# EAGLE design Lab Controller Board (EAGLE 7.3.0)
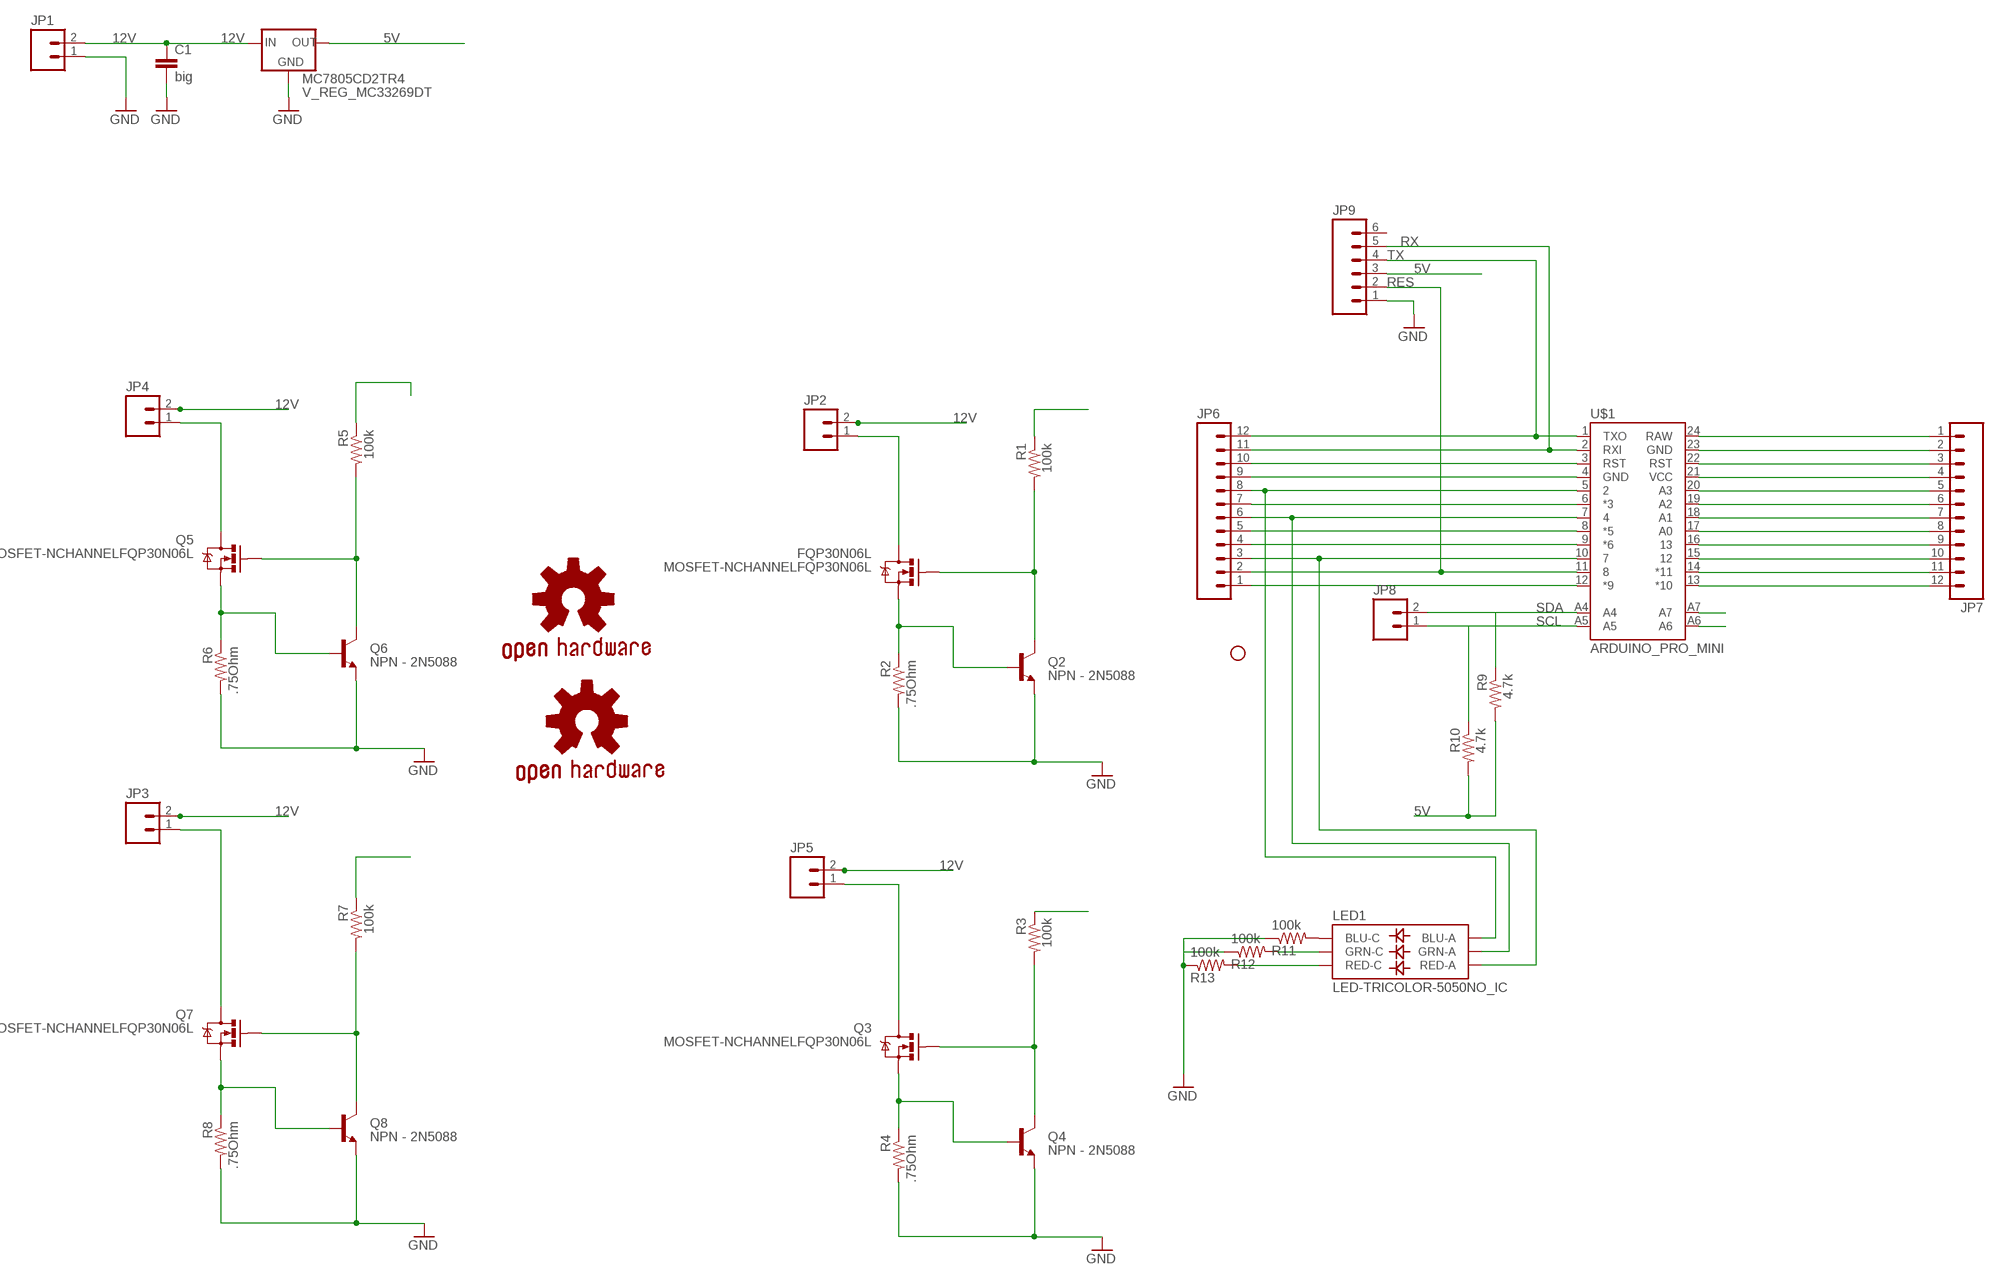
[diagram p0: schematic, sheet 1]

## Parts
C1  big  CAPPTH1  [CAP-PTH-5MM]
FQP30N06L  MOSFET-NCHANNELFQP30N06L  [TO220V]
GOLD_ORB_SM1  OSHWLOGO_GOLD_ORB_MED  [OSHW1]
GOLD_ORB_SM2  OSHWLOGO_GOLD_ORB_SM  [OSHW2]
JP1  M025MM  [SCREWTERMINAL-5MM-2]
JP2  M025MM  [SCREWTERMINAL-5MM-2]
JP3  M025MM  [SCREWTERMINAL-5MM-2]
JP4  M025MM  [SCREWTERMINAL-5MM-2]
JP5  M025MM  [SCREWTERMINAL-5MM-2]
JP6  M12PTH  [1X12]
JP7  M12PTH  [1X12]
JP8  M02LOCK  [1X02_LOCK]
JP9  M06LOCK  [1X06_LOCK]
LED1  LED-TRICOLOR-5050NO_IC  [LED-TRICOLOR-5050]
MC7805CD2TR4  V_REG_MC33269DT  [DPAK]
Q2  NPN - 2N5088  TRANSISTOR_NPNTO92  [TO-92]
Q3  MOSFET-NCHANNELFQP30N06L  [TO220V]
Q4  NPN - 2N5088  TRANSISTOR_NPNTO92  [TO-92]
Q5  MOSFET-NCHANNELFQP30N06L  [TO220V]
Q6  NPN - 2N5088  TRANSISTOR_NPNTO92  [TO-92]
Q7  MOSFET-NCHANNELFQP30N06L  [TO220V]
Q8  NPN - 2N5088  TRANSISTOR_NPNTO92  [TO-92]
R1  100k  R-US_R0805W  [R0805W]
R2  .75Ohm  R-US_0411/3V  [0411V]
R3  100k  R-US_R0805W  [R0805W]
R4  .75Ohm  R-US_0411/3V  [0411V]
R5  100k  R-US_R0805W  [R0805W]
R6  .75Ohm  R-US_0411/3V  [0411V]
R7  100k  R-US_R0805W  [R0805W]
R8  .75Ohm  R-US_0411/3V  [0411V]
R9  4.7k  R-US_M0805  [M0805]
R10  4.7k  R-US_M0805  [M0805]
R11  100k  R-US_R0805W  [R0805W]
R12  100k  R-US_R0805W  [R0805W]
R13  100k  R-US_R0805W  [R0805W]
STANDOFF1  STAND-OFF  [STAND-OFF]
U$1  ARDUINO_PRO_MINI  [ARDUINO_PRO_MINI]

## Nets
5V: JP9.3 MC7805CD2TR4.4(OUT) R9.2 R10.2
12V: C1.1 JP1.2 JP2.2 JP3.2 JP4.2 JP5.2 MC7805CD2TR4.3(IN)
APM_PIN_3: JP6.7 R3.1 U$1.6(*3)
APM_PIN_5: JP6.5 R1.1 U$1.8(*5)
APM_PIN_6: JP6.4 R7.1 U$1.9(*6)
APM_PIN_9: JP6.1 R5.1 U$1.12(*9)
FET_SOURCE: FQP30N06L.3(S) Q2.2(B) R2.1
FET_SOURCE1: Q3.3(S) Q4.2(B) R4.1
FET_SOURCE2: Q5.3(S) Q6.2(B) R6.1
FET_SOURCE3: Q7.3(S) Q8.2(B) R8.1
GND: C1.2 JP1.1 JP9.1 MC7805CD2TR4.1(GND) Q2.1(E) Q4.1(E) Q6.1(E) Q8.1(E) R2.2 R4.2 R6.2 R8.2 R11.1 R12.1 R13.1
LED_DRAIN: FQP30N06L.2(D) JP2.1
LED_DRAIN1: JP5.1 Q3.2(D)
LED_DRAIN2: JP4.1 Q5.2(D)
LED_DRAIN3: JP3.1 Q7.2(D)
N$3: JP6.10 U$1.3(RST)
N$4: JP6.9 U$1.4(GND)
N$5: JP6.8 LED1.3(BLU-A) U$1.5
N$6: LED1.4(BLU-C) R11.2
N$7: JP6.6 LED1.1(GRN-A) U$1.7
N$8: LED1.6(GRN-C) R12.2
N$9: LED1.5(RED-C) R13.2
N$10: JP6.3 LED1.2(RED-A) U$1.10
N$15: JP7.1 U$1.24(RAW)
N$16: JP7.2 U$1.23(GND)
N$17: JP7.3 U$1.22(RST)
N$18: JP7.4 U$1.21(VCC)
N$19: JP7.5 U$1.20(A3)
N$20: JP7.6 U$1.19(A2)
N$21: JP7.7 U$1.18(A1)
N$22: JP7.8 U$1.17(A0)
N$23: JP7.9 U$1.16
N$24: JP7.10 U$1.15
N$25: JP7.11 U$1.14(*11)
N$26: JP7.12 U$1.13(*10)
N$27: U$1.A7
N$28: U$1.A6
PWM_B: FQP30N06L.1(G) Q2.3(C) R1.2
PWM_B1: Q3.1(G) Q4.3(C) R3.2
PWM_B2: Q5.1(G) Q6.3(C) R5.2
PWM_B3: Q7.1(G) Q8.3(C) R7.2
RES: JP6.2 JP9.2 U$1.11
RX: JP6.11 JP9.5 U$1.2(RXI)
SCL: JP8.1 R10.1 U$1.A5
SDA: JP8.2 R9.1 U$1.A4
TX: JP6.12 JP9.4 U$1.1(TXO)
Unconnected: JP9.6

## Library data of the parts
C1 = SparkFun-Passives:CAP: Capacitor Standard 0603 ceramic capacitor, and 0.1" leaded capacitor.
FQP30N06L Q3 Q5 Q7 = SparkFun-DiscreteSemi:MOSFET-NCHANNEL: Common NMOSFET Parts MFG P/N Store ID Prod ID FDD8780 TRANS-09984 SI7820DN TRANS-11055 FDS6630A IC-08089 2N7002PW TRANS-11151 FQP30N06L COM-10213 TRANS-10060 BSS123LT1G TRANS-08345 BSS138 TRANS-00830 BS170 2N7000; PROD_ID: TRANS-10060
GOLD_ORB_SM1 GOLD_ORB_SM2 = bfl:OSHWLOGO: These are Open-Source Hardware logos.
JP1-JP5 = SparkFun-Connectors:M02: Standard 2-pin 0.1" header. Use with - straight break away headers ( PRT-00116) - right angle break away headers (PRT-00553) - swiss pins (PRT-00743) - machine pins (PRT-00117) - female headers (PRT-00115) Molex polarized connector foot print use with: PRT-08233 with associated crimp pins and housings. 2.54_SCREWTERM for use with PRT-10571. 3.5mm Screw Terminal footprints for PRT-08084 5mm Screw Terminal footprints for use with PRT-08432; STOREFRONT_ID: PRT-08432
JP6 JP7 = SparkFun-Connectors:M12: Header 12 Standard 12-pin 0.1" header. Use with straight break away headers (SKU : PRT-00116), right angle break away headers (PRT-00553), swiss pins (PRT-00743), machine pins (PRT-00117), and female headers (PRT-00115).
JP8 = SparkFun-Connectors:M02: Standard 2-pin 0.1" header. Use with - straight break away headers ( PRT-00116) - right angle break away headers (PRT-00553) - swiss pins (PRT-00743) - machine pins (PRT-00117) - female headers (PRT-00115) Molex polarized connector foot print use with: PRT-08233 with associated crimp pins and housings. 2.54_SCREWTERM for use with PRT-10571. 3.5mm Screw Terminal footprints for PRT-08084 5mm Screw Terminal footprints for use with PRT-08432
JP9 = SparkFun-Connectors:M06: Header 6 Standard 6-pin 0.1" header. Use with straight break away headers (SKU : PRT-00116), right angle break away headers (PRT-00553), swiss pins (PRT-00743), machine pins (PRT-00117), and female headers (PRT-00115). Molex polarized connector foot print use with SKU : PRT-08094 with associated crimp pins and housings. NOTES ON THE VARIANTS LOCK and LOCK_LONGPADS... This footprint was designed to help hold the alignment of a through-hole component (i.e. 6-pin header) while soldering it into place. You may notice that each hole has been shifted either up or down by 0.005 of an inch from it's more standard position (which is a perfectly straight line). This slight alteration caused the pins (the squares in the middle) to touch the edges of the holes. Because they are alternating, it causes a "brace" to hold the component in place. 0.005 has proven to be the perfect amount of "off-center" position when using our standard breakaway headers. Although looks a little odd when you look at the bare footprint, once you have a header in there, the alteration is very hard to notice. Also,if you push a header all the way into place, it is covered up entirely on the bottom side. This idea of altering the position of holes to aid alignment will be further integrated into the Sparkfun Library for other footprints. It can help hold any component with 3 or more connection pins.
LED1 = SparkFun-LED:LED-TRICOLOR-5050
MC7805CD2TR4 = SparkFun-PowerIC:V_REG_MC33269
Q2 Q4 Q6 Q8 = SparkFun-DiscreteSemi:TRANSISTOR_NPN: Generic NPN BJT MMBT2222A - TRANS-08049 (SOT-23, 1A 40V) MPSA42 - TRANS-09116 (SOT-23, 500mA 300V) MMBT5088LT1G - TRANS-11160 (SOT-23, 50 mA 30V)
R1-R13 = resistor:R-US_: RESISTOR, American symbol
STANDOFF1 = SparkFun-Electromechanical:STAND-OFF: #4 Stand Off This is the mechanical footprint for a #4 phillips button head screw. Use the keepout ring to avoid running the screw head into surrounding components. SKU : PRT-00447
U$1 = SparkFun-Boards:ARDUINO_PRO_MINI

## Board
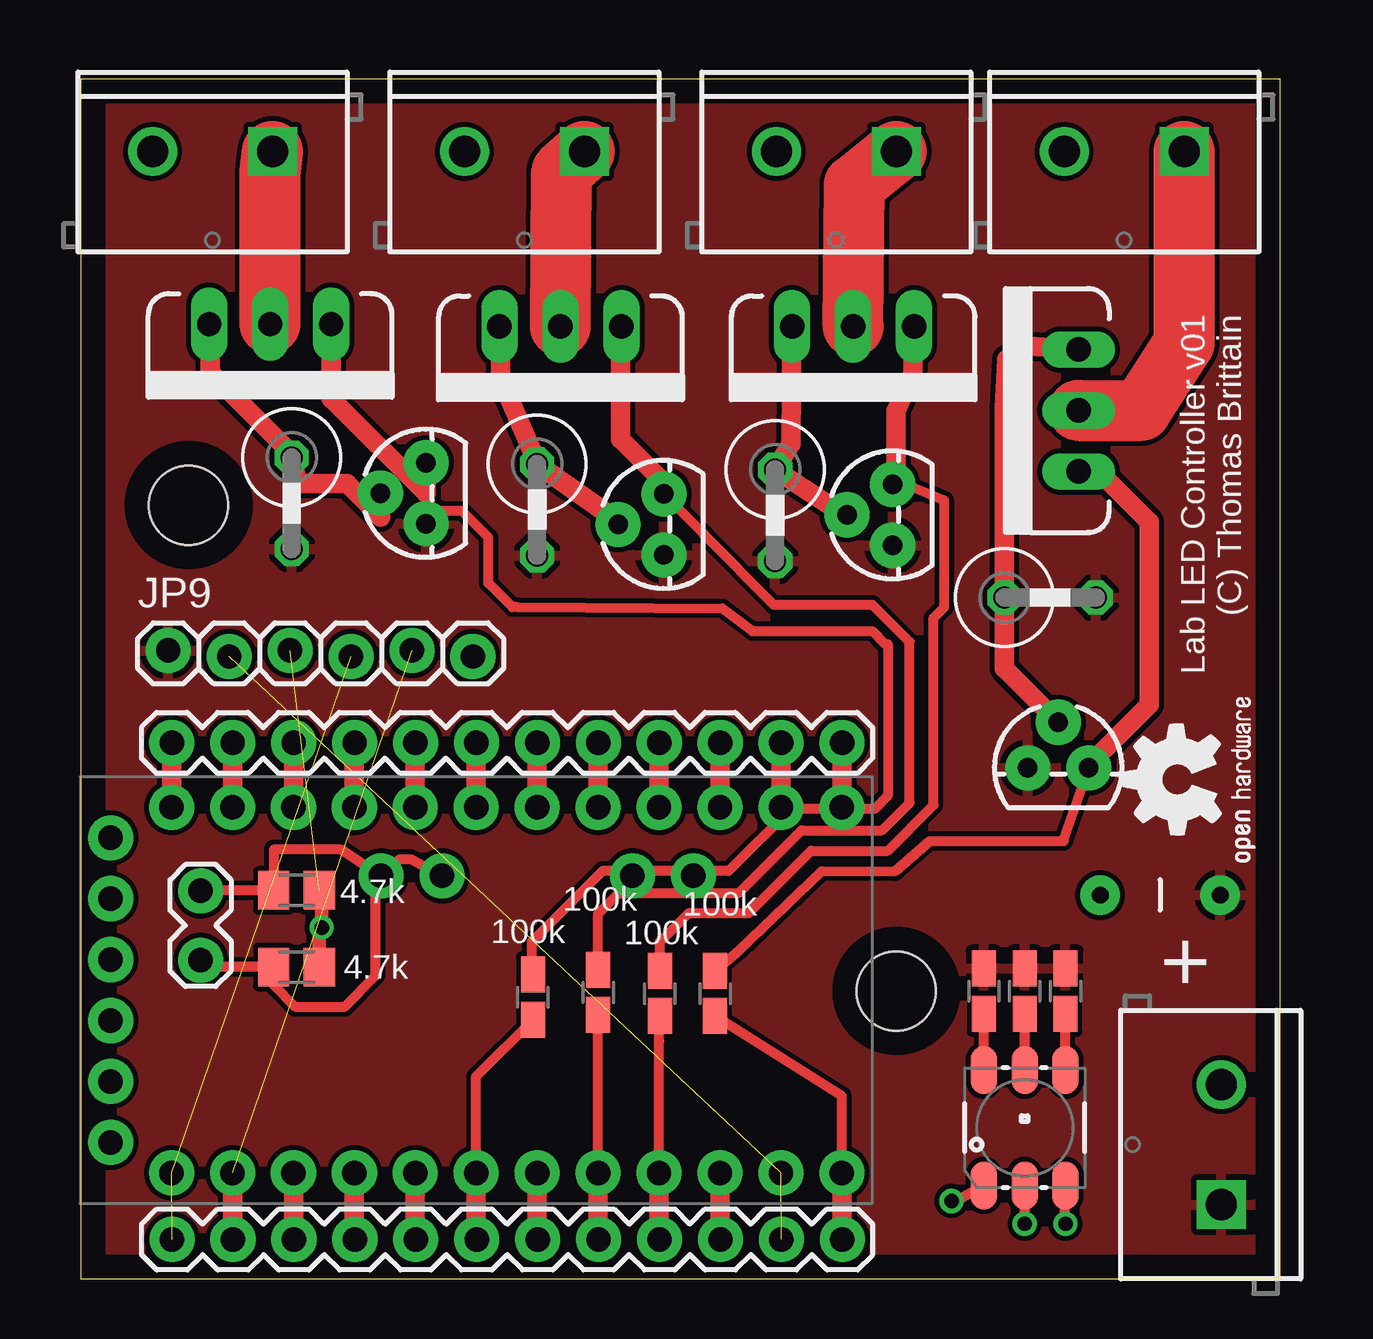
[diagram p1: board, top side]
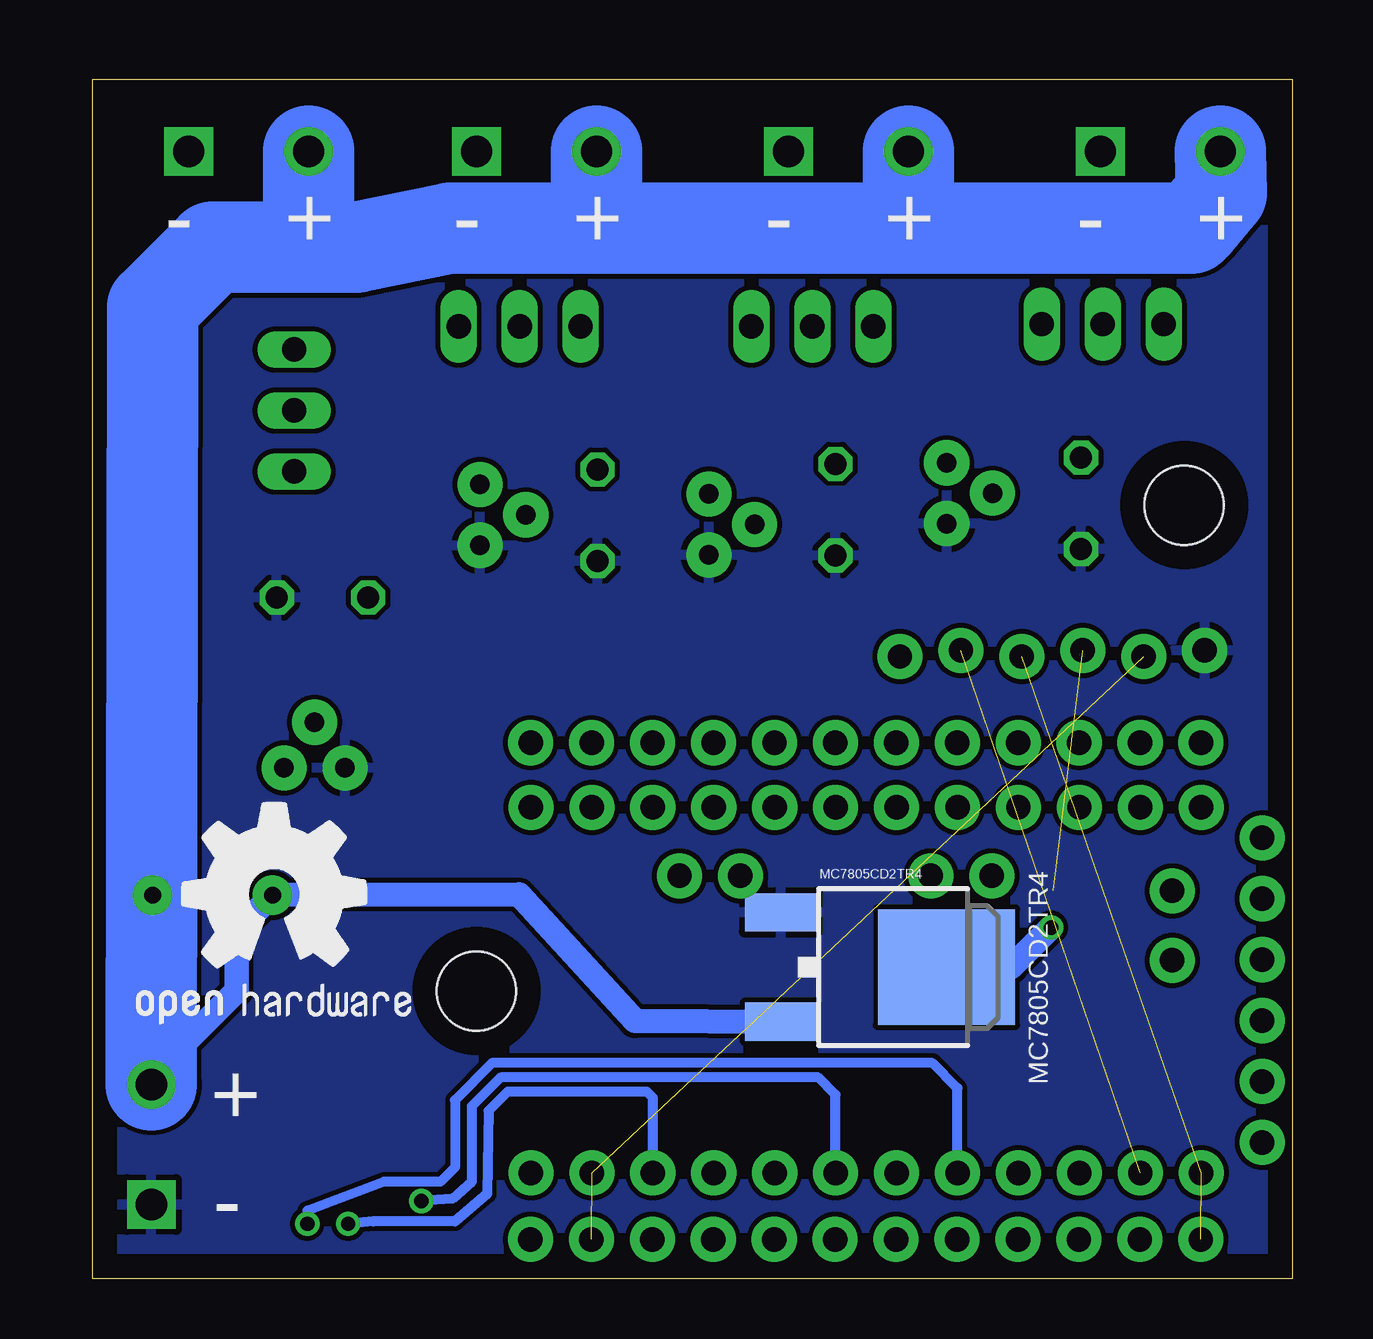
[diagram p2: board, bottom side, seen from below]

Size 50 x 50 mm. Coordinates in mm from the lower left corner, seen from the top.
Outline: 0,0 50,0 50,50 0,50 0,0
Copper layers (1*16): Top 0.035mm / dielectric 1.5mm / Bottom 0.035mm
Design rules "default": minimum track width 10mil, minimum drill 24mil, track to track 8mil, track to pad 8mil, pad to pad 8mil, via to via 8mil, smd to smd 8mil, copper to edge 40mil, drill to drill 8mil, minimum pad ring 10mil, minimum via ring 8mil, stop-mask expansion 4mil, vias tented up to drill 0mil, thermal gap 10mil

### Footprints (pad centres in the part's own frame; a part is rotated, then mirrored left to right if it is on the bottom)
CAP-PTH-5MM = drill 0.7 pad 1.651: 1 -2.5,0; 2 2.5,0
TO220V = drill 1.016 long: 1 -2.54,0; 2 0,0; 3 2.54,0
SCREWTERMINAL-5MM-2 = drill 1.3 pad 2.032 square: 1 0,0 | drill 1.3 pad 2.032: 2 5,0
1X12 = drill 1.016 pad 1.88: 1 0,0; 2 2.54,0; 3 5.08,0; 4 7.62,0; 5 10.16,0; 6 12.7,0; 7 15.24,0; 8 17.78,0; 9 20.32,0; 10 22.86,0; 11 25.4,0; 12 27.94,0
1X02_LOCK = drill 1.016 pad 1.88: 1 -0.178,0; 2 2.718,0
1X06_LOCK = drill 1.016 pad 1.88: 1 0,0; 2 2.54,-0.254; 3 5.08,0; 4 7.62,-0.254; 5 10.16,0; 6 12.7,-0.254
LED-TRICOLOR-5050 = smd 2 x 1.1: 1 -2.4,1.7; 2 -2.4,0; 3 -2.4,-1.7; 4 2.4,-1.7; 5 2.4,0; 6 2.4,1.7
DPAK = smd 1.6 x 3: 1 -2.28,-5.31; 3 2.28,-5.31 | smd 4.826 x 5.715: 4 0,1.588
TO-92 = drill 0.813 pad 1.88: 1 -1.27,0; 2 0,1.905; 3 1.27,0
R0805W = smd 1.5 x 1: 1 -0.94,0; 2 0.94,0
0411V = drill 0.914 octagon: 1 -2.54,0; 2 1.27,0
M0805 = smd 1.3 x 1.6: 1 -0.95,0; 2 0.95,0
STAND-OFF = hole 3.302: 0,0
ARDUINO_PRO_MINI = drill 1.016 pad 1.88: 1 -7.62,12.7; 2 -7.62,10.16; 3 -7.62,7.62; 4 -7.62,5.08; 5 -7.62,2.54; 6 -7.62,0; 7 -7.62,-2.54; 8 -7.62,-5.08; 9 -7.62,-7.62; 10 -7.62,-10.16; 11 -7.62,-12.7; 12 -7.62,-15.24; 13 7.62,-15.24; 14 7.62,-12.7; 15 7.62,-10.16; 16 7.62,-7.62; 17 7.62,-5.08; 18 7.62,-2.54; 19 7.62,0; 20 7.62,2.54; 21 7.62,5.08; 22 7.62,7.62; 23 7.62,10.16; 24 7.62,12.7; A4 4.763,1.429; A5 4.763,3.969; A6 4.763,-9.049; A7 4.763,-6.509; BLK -6.35,15.24; GND -3.81,15.24; GRN 6.35,15.24; RXI 1.27,15.24; TXO 3.81,15.24; VCC -1.27,15.24

### Placement (x,y rotation side)
C1  45,16 0 top
FQP30N06L  20,39.7 180 top
GOLD_ORB_SM1  48.8,8.9 0 bottom
GOLD_ORB_SM2  50,17 90 top
JP1  47.55,3.1 90 top
JP2  21,47 180 top
JP3  34,47 180 top
JP4  46,47 180 top
JP5  8,47 180 top
JP6  31.75,1.65 180 top
JP7  3.8,22.35 0 top
JP8  5,16 270 top
JP9  3.65,26.2 0 top
LED1  39.35,6.3 90 top
MC7805CD2TR4  16,13 270 bottom
Q2  24.31,31.45 90 top
Q3  7.9,39.8 180 top
Q4  14.4,32.75 90 top
Q5  41.6,36.2 90 top
Q6  40.75,21.3 0 top
Q7  32.2,39.7 180 top
Q8  33.85,31.85 90 top
R1  21.57,11.94 90 top
R2  19.03,31.43 270 top
R3  18.85,11.75 90 top
R4  8.8,31.7 270 top
R5  26.45,11.9 90 top
R6  41.05,28.4 0 top
R7  24.15,11.9 90 top
R8  28.95,31.2 270 top
R9  9,13 0 top
R10  9,16.2 0 top
R11  41.05,12 270 top
R12  37.65,12 270 top
R13  39.35,12 270 top
STANDOFF1  4.5,32.25 0 top
STANDOFF2  STAND-OFF  [STAND-OFF]  34,12 0 top
U$1  16.49,12.04 90 top

### Tracks (layer width: path | path; a pad name or v marks a point on that pad's centre or on a via)
5V  (via drill 0.6)  (1 unrouted)
  Top 0.559: R10.2 10.05,16.1 v10.05,14.65 9.95,14.55 R9.2
  Bottom 1.016: MC7805CD2TR4.4 11.7,13 v10.05,14.65
12V
  Bottom 0.406: JP1.2 47.55,8.45
  Bottom 1.016: MC7805CD2TR4.3 27.4,10.75 32.22,16.02 C1.1 44,14.5 44,12 47.55,8.45
  Bottom 3.81: JP1.2 47.5,39.95 47.5,40.5 45,43 41,43 | 41,43 39,43 35.1,43.8 29,43.8 | JP4.2 41,43 | 29,43.8 16,43.8 | 16,43.8 4.2,43.8 4,44 2.95,45.25 JP5.2 | JP2.2 16,43.8 | JP3.2 29,43.8
APM_PIN_3
  Top 0.406: U$1.6 16.49,8.45 R3.1
  Top 0.813: U$1.6 16.49,2.67 JP6.7
APM_PIN_5
  Top 0.406: U$1.8 R1.1
  Top 0.813: U$1.8 21.57,2.67 JP6.5
APM_PIN_6
  Top 0.406: U$1.9 24.11,9.92 R7.1
  Top 0.813: U$1.9 24.11,2.67 JP6.4
APM_PIN_9
  Top 0.406: U$1.12 31.73,7.63 R5.1
  Top 0.813: U$1.12 31.73,2.67 JP6.1
FET_SOURCE
  Top 0.406: Q2.2 22.41,31.59 | 17.5,39.66 FQP30N06L.3
  Top 0.813: FQP30N06L.3 17.46,39.66 | 22.41,31.59 R2.1 19.03,34.02 17.5,37.55 17.5,39.66
FET_SOURCE1
  Top 0.406: 5.3,39.74 Q3.3
  Top 0.813: 5.55,39.61 Q3.3 5.4,39.76 5.4,37.8 9.05,34.15 R4.1 9.06,33.15 11.1,33.15 12.49,31.75 Q4.2
FET_SOURCE2
  Top 0.813: Q5.3 39.54,38.89 38.6,38.35 38.5,36.3 38.51,30.49 R6.1 38.51,25.45 Q6.2
FET_SOURCE3
  Top 0.406: Q8.2 31.84,31.85
  Top 0.813: 31.84,31.85 R8.1 29.6,34.79 Q7.3
GND
  pour Bottom: -1,51 51,51 51,-2 -1,-2
  pour Top: -1,51 51,51 51,-2 -1,-2
LED_DRAIN
  Top 2.54: FQP30N06L.2 20.05,46.15 JP2.1
LED_DRAIN1
  Top 2.54: Q3.2 7.9,46.1 JP5.1
LED_DRAIN2
  Top 2.54: Q5.2 44.2,36.2 46,39 JP4.1
LED_DRAIN3
  Top 2.54: Q7.2 32.25,45.6 JP3.1
N$3
  Top 0.813: U$1.3 8.87,2.67 JP6.10
N$4
  Top 0.813: U$1.4 11.41,2.67 JP6.9
N$5  (via drill 0.6)
  Top 0.406: v41.05,2.3 41,3.25 LED1.3
  Top 0.813: U$1.5 13.95,2.67 JP6.8
  Bottom 0.406: U$1.5 13.95,7.95 15,9 33.35,9 34.9,7.45 34.9,4.65 35.5,4.05 37.85,4.05 41.05,2.85 v41.05,2.3
N$6
  Top 0.406: LED1.4 R11.2
N$7  (via drill 0.6)
  Top 0.406: v36.3,3.25 36.75,3.4 LED1.1
  Top 0.813: U$1.7 19.03,2.67 JP6.6
  Bottom 0.406: U$1.7 19.03,7.68 19.75,8.4 33,8.4 34.2,7.2 34.2,4.05 35,3.35 v36.3,3.25
N$8
  Top 0.406: LED1.6 R12.2
N$9
  Top 0.406: LED1.5 R13.2
N$10  (via drill 0.6)
  Top 0.406: v39.35,2.3 LED1.2
  Top 0.813: U$1.10 26.65,2.67 JP6.3
  Bottom 0.406: U$1.10 26.65,7.55 26.9,7.8 32.7,7.8 33.5,7 33.55,3.55 34.9,2.4 38.3,2.4 v39.35,2.3
N$15
  Top 0.813: U$1.24 JP7.1
N$16
  Top 0.813: U$1.23 6.33,21.34 JP7.2
N$17
  Top 0.813: U$1.22 8.87,21.34 JP7.3
N$18
  Top 0.813: U$1.21 11.41,21.34 JP7.4
N$19
  Top 0.813: U$1.20 13.95,21.34 JP7.5
N$20
  Top 0.813: U$1.19 16.49,21.34 JP7.6
N$21
  Top 0.813: U$1.18 19.03,21.34 JP7.7
N$22
  Top 0.813: U$1.17 21.57,21.34 JP7.8
N$23
  Top 0.813: U$1.16 24.11,21.34 JP7.9
N$24
  Top 0.813: U$1.15 26.65,21.34 JP7.10
N$25
  Top 0.813: U$1.14 29.19,21.34 JP7.11
N$26
  Top 0.813: U$1.13 31.73,21.34 JP7.12
PWM_B
  Top 0.406: R1.2 21.57,15.22 22.45,16.1 27.45,16.1 30.05,18.7 33.4,18.7 34.55,19.85 34.55,26.55 33,28.1 28.9,28.1 26,31 26,31.03 Q2.3
  Top 0.813: Q2.3 24.31,33.19 22.5,35 22.5,39.66 FQP30N06L.1
PWM_B1
  Top 0.406: R3.2 18.8,12.74 18.8,14.05 21.75,17 27,17 29.6,19.6 33.1,19.6 33.65,20.15 33.65,26.45 33.55,26.45 33,27 28,27 26.75,27.95 18.2,28 18,28 17,29 17,30.9 15.9,32 14.42,32 Q4.3
  Top 0.813: Q3.1 10.45,36.7 14.4,32.75 Q4.3
PWM_B2
  Top 0.406: R5.2 27.45,13.7 30.9,17 33.94,16.99 35.4,18.25 40.97,18.25 Q6.3
  Top 0.813: Q6.3 42.02,21.42 44.55,23.95 44.55,31.55 42.45,33.65 40.71,33.65 Q5.1
PWM_B3
  Top 0.406: R7.2 24.15,14.05 25.35,15.25 27.85,15.25 30.45,17.85 33.65,17.85 35.55,19.75 35.55,27.55 36,28 36,32.45 34.05,33.25 | 33.98,33.25 Q8.3
  Top 0.813: 34.05,33.25 33.98,33.25 | 33.98,33.25 33.85,33.25 | Q7.1 34.7,39.66 34.7,37.75 33.98,36.18 33.98,33.25
RES  (2 unrouted)
RX  (1 unrouted)
  Top 0.813: U$1.2 6.33,2.67 JP6.11
SCL
  Top 0.406: U$1.A5 10.85,17.9 8.05,17.9 R10.1 5.02,16.2 JP8.1
SDA
  Top 0.406: U$1.A4 13.76,17.5 13.3,17.5 12.3,16.5 12.3,12.65 11,11.35 8.95,11.35 8.05,12.25 R9.1 5.28,13 JP8.2
TX  (2 unrouted)

### Text on the board
tNames: Lab LED Controller v01 / (C) Thomas Brittain | 4.7k | 100k | 100k | 100k | 100k | 4.7k | +
bNames: + | - | + | - | + | - | + | - | MC7805CD2TR4 | + | -
_tsilk: GND | .75